# EAGLE design RPCamV2_Alt_camera_board (EAGLE 9.3.0)
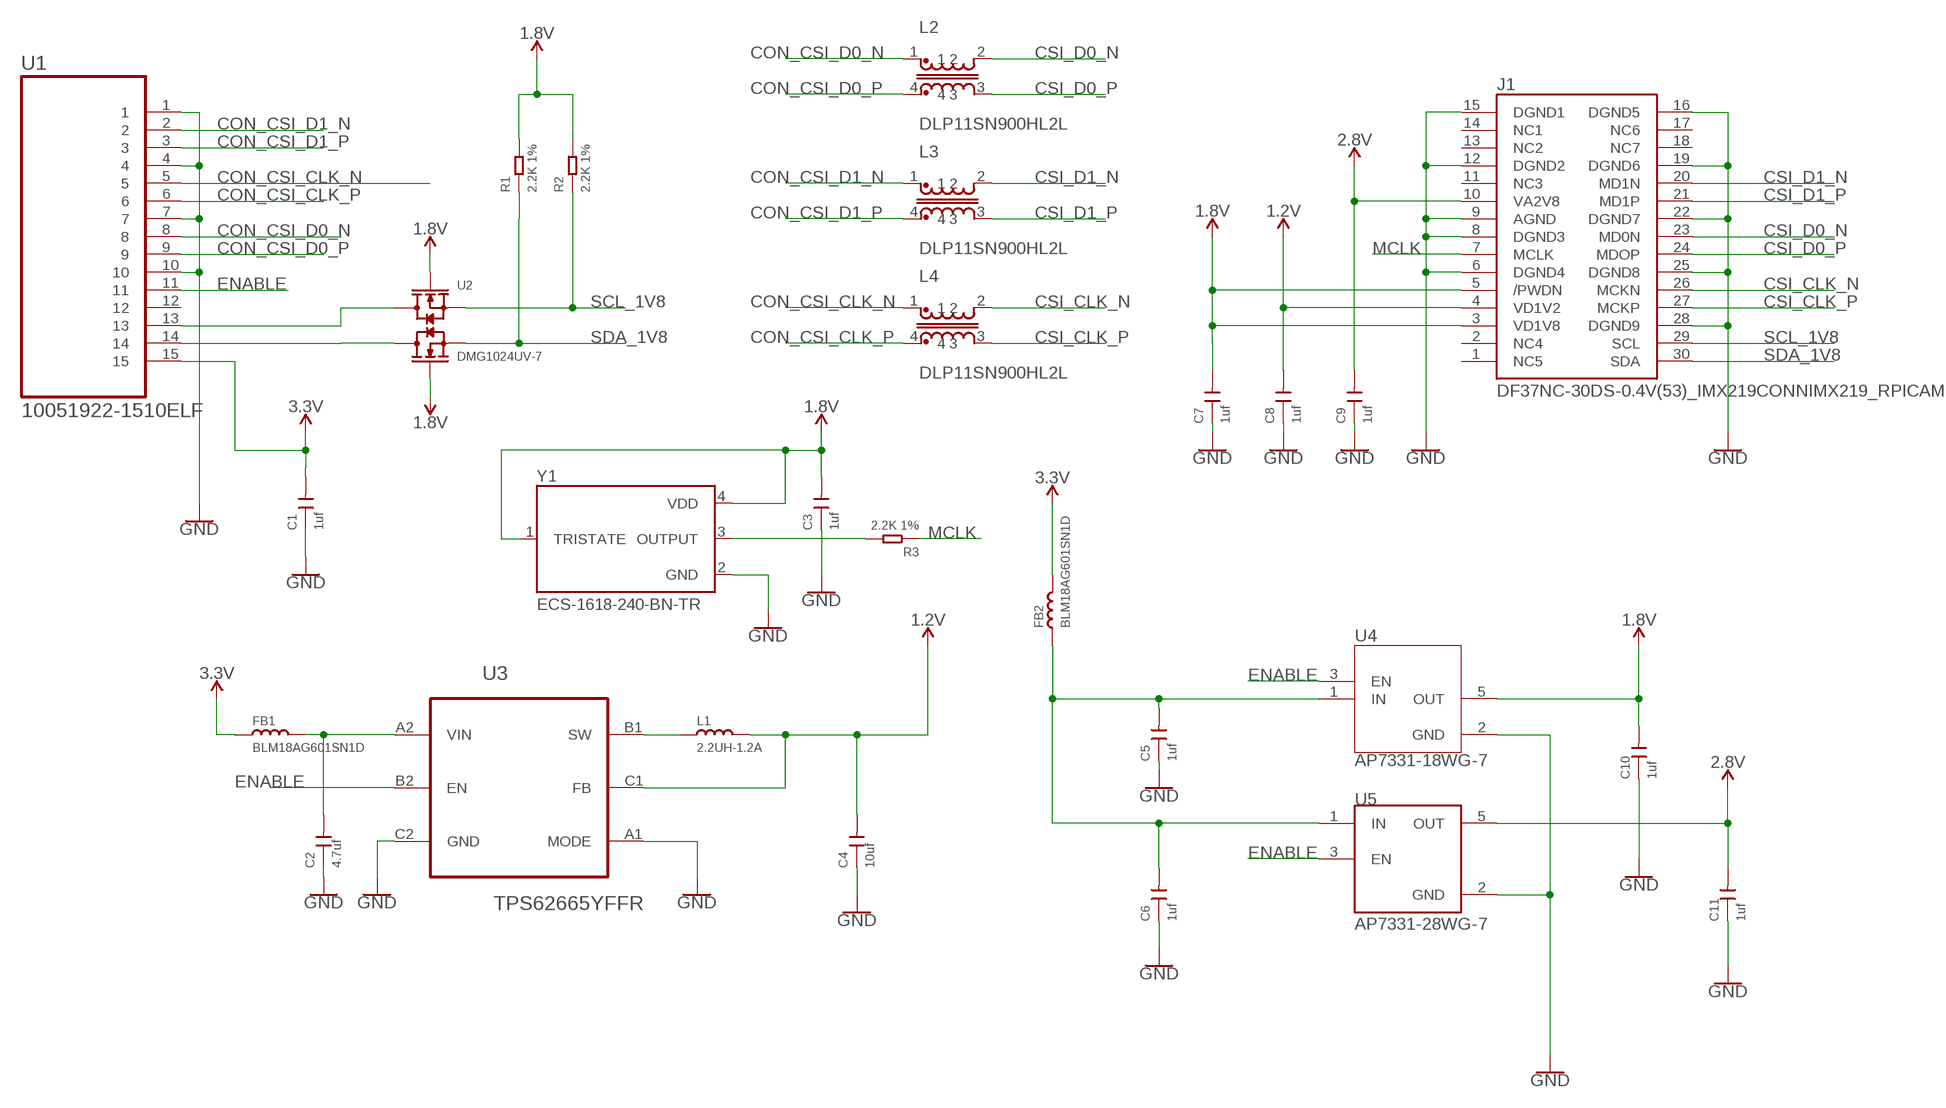
[diagram p0: schematic, sheet 1]

## Parts
C1  1uf  CERAMIC-1UF-10V-10%-X5R(0402)  [C0402]
C2  4.7uf  CERAMIC-4.7UF-10V-10%-X5R(0603)  [C0603]
C3  1uf  CERAMIC-1UF-10V-10%-X5R(0402)  [C0402]
C4  10uf  CERAMIC-10UF-25V-10%-X5R(0805)  [C0805]
C5  1uf  CERAMIC-1UF-10V-10%-X5R(0402)  [C0402]
C6  1uf  CERAMIC-1UF-10V-10%-X5R(0402)  [C0402]
C7  1uf  CERAMIC-1UF-10V-10%-X5R(0402)  [C0402]
C8  1uf  CERAMIC-1UF-10V-10%-X5R(0402)  [C0402]
C9  1uf  CERAMIC-1UF-10V-10%-X5R(0402)  [C0402]
C10  1uf  CERAMIC-1UF-10V-10%-X5R(0402)  [C0402]
C11  1uf  CERAMIC-1UF-10V-10%-X5R(0402)  [C0402]
FB1  BLM18AG601SN1D  [LEDM1608X80]
FB2  BLM18AG601SN1D  [LEDM1608X80]
J1  DF37NC-30DS-0.4V(53)_IMX219CONNIMX219_RPICAM  [HRS_DF37NC-30DS-0.4V(53)_IMX219]
L1  2.2UH-1.2A  SMD-INDUCTOR-2.2UH-20%-1.2A(0805)  [L0805]
L2  DLP11SN900HL2L  [INDC1210X09]
L3  DLP11SN900HL2L  [INDC1210X09]
L4  DLP11SN900HL2L  [INDC1210X09]
R1  2.2K 1%  SMD-RES-0R-5%-1/16W(0402)  [R0402]
R2  2.2K 1%  SMD-RES-0R-5%-1/16W(0402)  [R0402]
R3  2.2K 1%  SMD-RES-0R-5%-1/16W(0402)  [R0402]
U1  10051922-1510ELF  [FCI_10051922-1510ELF]
U2  DMG1024UV-7  [SOT50P162X60-6N]
U3  TPS62665YFFR  [BGA6C40P2X3_130X93X63]
U4  AP7331-18WG-7  [SOT95P285X145-5N]
U5  AP7331-28WG-7  [SOT95P285X145-5N]
Y1  ECS-1618-240-BN-TR  [XTAL_ECS-1618-060-BN-TR]

## Nets
1.2V [pwr]: C4.2 C8.2 J1.4(VD1V2) L1.2 U3.C1(FB)
1.8V [pwr]: C3.2 C7.2 C10.2 J1.3(VD1V8) J1.5(/PWDN) R1.2 R2.2 U2.G1(G0) U2.G2(G1) U4.5(OUT) Y1.1(TRISTATE) Y1.4(VDD)
2.8V [pwr]: C9.2 C11.2 J1.10(VA2V8) U5.5(OUT)
3V3 [pwr]: C1.2 FB1.A FB2.C U1.15 ; supply symbol labelled 3.3V
CON_CSI_CLK_N [diff pairs]: L4.1 U1.5
CON_CSI_CLK_P [diff pairs]: L4.4 U1.6
CON_CSI_D0_N [diff pairs]: L2.1 U1.8
CON_CSI_D0_P [diff pairs]: L2.4 U1.9
CON_CSI_D1_N [diff pairs]: L3.1 U1.2
CON_CSI_D1_P [diff pairs]: L3.4 U1.3
CSI_CLK_N [diff pairs]: J1.26(MCKN) L4.2
CSI_CLK_P [diff pairs]: J1.27(MCKP) L4.3
CSI_D0_N [diff pairs]: J1.23(MD0N) L2.2
CSI_D0_P [diff pairs]: J1.24(MDOP) L2.3
CSI_D1_N [diff pairs]: J1.20(MD1N) L3.2
CSI_D1_P [diff pairs]: J1.21(MD1P) L3.3
ENABLE: U1.11 U3.B2(EN) U4.3(EN) U5.3(EN)
GND [pwr]: C1.1 C2.1 C3.1 C4.1 C5.1 C6.1 C7.1 C8.1 C9.1 C10.1 C11.1 J1.6(DGND4) J1.8(DGND3) J1.9(AGND) J1.12(DGND2) J1.15(DGND1) J1.16(DGND5) J1.19(DGND6) J1.22(DGND7) J1.25(DGND8) J1.28(DGND9) U1.1 U1.4 U1.7 U1.10 U3.A1(MODE) U3.C2(GND) U4.2(GND) U5.2(GND) Y1.2(GND)
IN_PR: C5.2 C6.2 FB2.A U4.1(IN) U5.1(IN)
MCLK: J1.7(MCLK) R3.1
N$1: C2.2 FB1.C U3.A2(VIN)
N$2: U1.13 U2.D2(D1)
N$3: U1.14 U2.D1(D0)
N$5: R3.2 Y1.3(OUTPUT)
N$7 [pwr]: L1.1 U3.B1(SW)
SCL_1V8: J1.29(SCL) R2.1 U2.S2(S1)
SDA_1V8: J1.30(SDA) R1.1 U2.S1(S0)
Unconnected: J1.1(NC5) J1.2(NC4) J1.11(NC3) J1.13(NC2) J1.14(NC1) J1.17(NC6) J1.18(NC7) U1.12

## Library data of the parts
C1 C3 C5-C11 = Seeed-Capacitor:CERAMIC-1UF-10V-10%-X5R(0402): 302010040; MPN: CC0402KRX5R6BB105
C2 = Seeed-Capacitor:CERAMIC-4.7UF-10V-10%-X5R(0603): 302010111; MPN: CC0603KRX5R6BB475
C4 = Seeed-Capacitor:CERAMIC-10UF-25V-10%-X5R(0805): 302010178; MPN: CC0805KKX5R8BB106
FB1 FB2 = RPI_CAM:BLM18AG601SN1D
J1 = RPI_CAM:DF37NC-30DS-0.4V(53)_IMX219CONN: Connector, Stacking, Rcpt, 30pos, 2row
L1 = Seeed-Inductor:SMD-INDUCTOR-2.2UH-20%-1.2A(0805): 303010086; MPN: LQM2MPN2R2MG0
L2-L4 = DLP11SN900HL2L:DLP11SN900HL2L: MURATA# DLP11SN900HL2L, D LP Series 90 Ohm Impedanc e 20 % 150 mA DCR 1.5 Ohm SMT Common Mode Choke; AVAILABILITY: Unavailable; DESCRIPTION: MURATA# DLP11SN900HL2L, D LP Series 90 Ohm Impedanc e 20 % 150 mA DCR 1.5 Ohm SMT Common Mode Choke; MF: Murata; MP: DLP11SN900HL2L; PACKAGE: 1210 Murata; PRICE: None
R1-R3 = Seeed-Resistor:SMD-RES-0R-5%-1/16W(0402): 301010000; MPN: RC0402JR-070RL; VALUE: 0R
U1 = RPI_CAM:10051922-1510ELF: FFC/FPC CONNECTOR, 15POS, 1ROW; AVAILABILITY: Good; DESCRIPTION: Conn; Rect; FPC/FFC; ZIF; 15Cnts; SMT; VLL Series; 0.5mmPinSpng; RtAng; LowerSideContact; MF: FCI; MP: 10051922-1510ELF; PACKAGE: None; PRICE: 0.44 USD
U2 = RPI_CAM:DMG1024UV-7: Dual N-Channel 20 V 450 mOhm Surface Mount Enhancement Mode Mosfet - SOT-563; AVAILABILITY: Good; DESCRIPTION: Dual N-Channel 20 V 450 mOhm Surface Mount Enhancement Mode Mosfet - SOT-563; MF: Diodes Inc.; MP: DMG1024UV-7; PACKAGE: SOT-563 Diodes Inc.; PRICE: 0.19 USD
U3 = RPI_CAM:TPS62665YFFR: STEP-DOWN CONVERTER; AVAILABILITY: Good; DESCRIPTION: 1000mA, 6-MHz Synchronous Step-Down Converter in Chip Scale Packaging 6-DSBGA -40 to 85; MF: Texas Instruments; MP: TPS62665YFFR; PACKAGE: DSBGA-6 Texas Instruments; PRICE: 0.98 USD
U4 = RPI_CAM:AP7331-18WG-7: LDO Regulator Pos 1.8V 0.3A 5-Pin SOT-25 T/R; AVAILABILITY: Good; DESCRIPTION: LDO Regulator Pos 1.8V 0.3A 5-Pin SOT-25 T/R; MF: Diodes Inc.; MP: AP7331-18WG-7; PACKAGE: SOT-753 Diodes Inc.; PRICE: 0.20 USD
U5 = RPI_CAM:AP7331-28WG-7: LDO Regulator Pos 2.8V 0.3A 5-Pin SOT-25 T/R; AVAILABILITY: Good; DESCRIPTION: LDO Regulator Pos 2.8V 0.3A 5-Pin SOT-25 T/R; MF: Diodes Inc.; MP: AP7331-28WG-7; PACKAGE: SOT-753 Diodes Inc.; PRICE: 0.21 USD
Y1 = RPI_CAM:ECS-1618-240-BN-TR: OSC XO 12.000MHZ CMOS SMD; DESCRIPTION: Clock Oscillator 24MHz 1.8V 15pF 4-Pin SMD T/R; DIGI-KEY_PART_NUMBER: XC1963CT-ND; DIGI-KEY_PURCHASE_URL: https://www.digikey.com.au/product-detail/en/ecs-inc/ECS-1618-240-BN-TR/XC1963CT-ND/3927364?utm_source=snapeda&utm_medium=aggregator&utm_campaign=symbol; MF: ECS International; MP: ECS-1618-240-BN-TR; PACKAGE: SMD-4 ECS International

## Net classes
1 diff pairs: width 0.152 mm, clearance 0.152 mm
2 pwr: width 0.203 mm

## Board
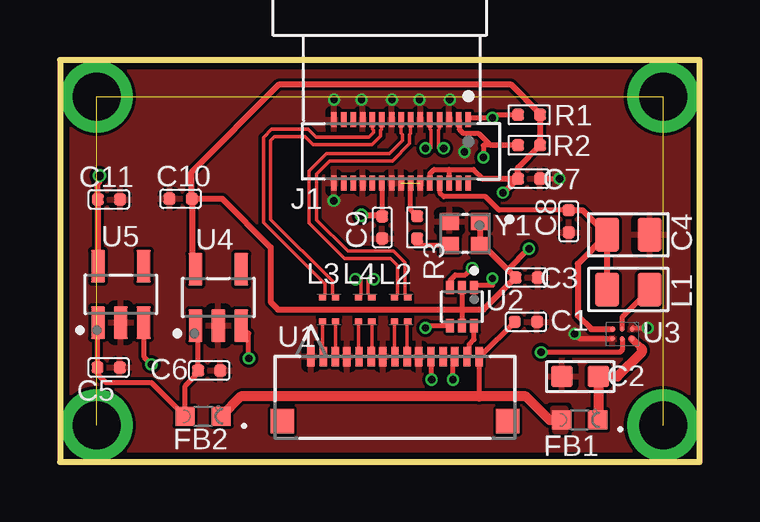
[diagram p1: board, top side]
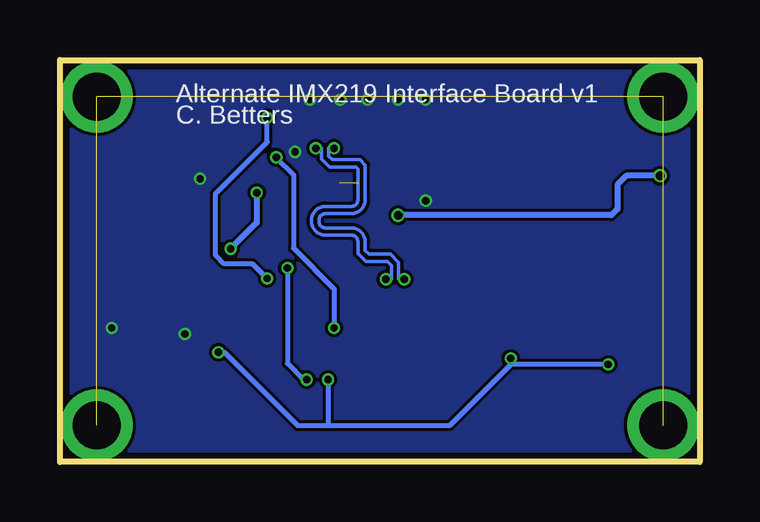
[diagram p2: board, bottom side, seen from below]

Size 26.67 x 16.76 mm. Coordinates in mm from the lower left corner, seen from the top.
Outline: 0,0 26.67,0 26.67,16.76 0,16.76 0,0
Copper layers (1*2*15*16): Top 0.035mm / dielectric 0.23mm / Route2 0.035mm / dielectric 0.93mm / Route15 0.035mm / dielectric 0.23mm / Bottom 0.035mm
Design rules "MF_Standard_4_Layer": minimum track width 5mil, minimum drill 10mil, track to track 5mil, track to pad 5mil, pad to pad 5mil, via to via 5mil, smd to smd 0mil, copper to edge 10mil, drill to drill 10mil, minimum pad ring 4mil, minimum via ring 4mil, stop-mask expansion 2mil, vias tented up to drill 25mil, thermal gap 10mil

### Footprints (pad centres in the part's own frame; a part is rotated, then mirrored left to right if it is on the bottom)
C0402 = smd 0.5 x 0.5: 1 0,0.463; 2 0,-0.463
C0603 = smd 0.889 x 0.889: 1 0,0.762; 2 0,-0.762
C0805 = smd 1.397 x 1.016: 1 0,0.889; 2 0,-0.889
LEDM1608X80 = smd 0.8 x 0.8: A 0.75,0; C -0.75,0
HRS_DF37NC-30DS-0.4V(53)_IMX219 = smd 0.23 x 0.63: 1 -2.8,1.325; 2 -2.4,1.325; 3 -2,1.325; 4 -1.6,1.325; 5 -1.2,1.325; 6 -0.8,1.325; 7 -0.4,1.325; 8 0,1.325; 9 0.4,1.325; 10 0.8,1.325; 11 1.2,1.325; 12 1.6,1.325; 13 2,1.325; 14 2.4,1.325; 15 2.8,1.325; 16 2.8,-1.325; 17 2.4,-1.325; 18 2,-1.325; 19 1.6,-1.325; 20 1.2,-1.325; 21 0.8,-1.325; 22 0.4,-1.325; 23 0,-1.325; 24 -0.4,-1.325; 25 -0.8,-1.325; 26 -1.2,-1.325; 27 -1.6,-1.325; 28 -2,-1.325; 29 -2.4,-1.325; 30 -2.8,-1.325
L0805 = smd 1.016 x 1.397: 1 -0.889,0; 2 0.889,0
INDC1210X09 = smd 0.25 x 0.3: 1 -0.5,0.275; 2 0.5,0.275; 3 0.5,-0.275; 4 -0.5,-0.275
R0402 = smd 0.5 x 0.5: 1 0,0.463; 2 0,-0.463
FCI_10051922-1510ELF = smd 0.305 x 0.813: 1 3.505,-2.108; 2 2.997,-2.108; 3 2.489,-2.108; 4 2.007,-2.108; 5 1.499,-2.108; 6 0.991,-2.108; 7 0.508,-2.108; 8 0,-2.108; 9 -0.508,-2.108; 10 -0.991,-2.108; 11 -1.499,-2.108; 12 -2.007,-2.108; 13 -2.489,-2.108; 14 -2.997,-2.108; 15 -3.505,-2.108 | smd 0.965 x 1.016: 16 -4.699,0.584; 17 4.699,0.584
SOT50P162X60-6N = smd 0.55 x 0.34: D1 0.795,0.5; D2 -0.795,-0.5; G1 -0.795,0; G2 0.795,0; S1 -0.795,0.5; S2 0.795,-0.5
BGA6C40P2X3_130X93X63 = smd 0.203 x 0.203: A1 -0.203,0.406; A2 0.203,0.406; B1 -0.203,0; B2 0.203,0; C1 -0.203,-0.406; C2 0.203,-0.406
SOT95P285X145-5N = smd 1.37 x 0.59: 1 -1.175,0.95; 2 -1.175,0; 3 -1.175,-0.95; 4 1.175,-0.95; 5 1.175,0.95
XTAL_ECS-1618-060-BN-TR = smd 0.8 x 0.7: 1 -0.65,-0.5; 2 0.65,-0.5; 3 0.65,0.5; 4 -0.65,0.5

### Placement (x,y rotation side)
C1  19.43,5.84 270 top
C2  21.69,3.56 90 top
C3  19.46,7.69 270 top
C4  23.7,9.47 270 top
C5  2.03,3.94 270 top
C6  6.22,3.81 270 top
C7  19.56,11.81 270 top
C8  21.21,10.03 180 top
C9  13.44,9.78 180 top
C10  5.03,10.97 90 top
C11  2.04,10.95 270 top
FB1  21.67,1.75 180 top
FB2  5.97,1.91 180 top
J1  14.22,12.95 180 top
L1  23.7,7.19 180 top
L2  14.22,6.35 90 top
L3  11.22,6.37 90 top
L4  12.73,6.37 90 top
R1  19.56,14.48 90 top
R2  19.56,13.21 90 top
R3  14.89,9.78 0 top
U1  13.97,2.29 180 top
U2  16.76,6.48 270 top
U3  23.44,5.33 270 top
U4  6.6,6.86 90 top
U5  2.54,6.99 90 top
Y1  16.89,9.53 180 top

### Tracks (layer width: path | path; a pad name or v marks a point on that pad's centre or on a via)
1.2V
  Top 0.203: C8.2 18.31,10.49 17.74,11.06 16,11.06 15.82,11.24 J1.4
  Top 0.254: C4.2 21.79,10.49 C8.2 | C4.2 L1.2 | C4.2 21.59,8.26 21.59,6.1 22.15,5.54 U3.C1
  Top 0.305: C8.2
1.8V  (via drill 0.3, 0.3 pad 0.36)
  Top 0.203: 16.23,12.2 J1.3 | J1.5 15.42,12.02 15.6,12.2 16.23,12.2 | 16.23,12.2 17.24,12.2 17.63,11.81 | U2.G1 16.76,6.36 U2.G2
  Top 0.254: C7.2 19.1,12.28 R2.2 R1.2 20.02,14.52 18.8,15.75 9.14,15.75 5.49,12.1 C10.2 | 17.63,11.81 C7.2 | C7.2 18.51,11.23 v18.47,11.23 | C3.2 17.66,9.03 Y1.4 Y1.1 | C3.2 17.66,6.36 16.76,6.36 9.09,6.36 8.78,6.67 8.78,8.95 6.76,10.97 C10.2 | v19.56,8.89 18.67,8.01 C3.2 | C10.2 5.53,10.94 5.53,8.16 U4.5
  Bottom 0.254: v19.56,8.89 18.47,9.98 v18.47,11.23
2.8V  (via drill 0.35)
  Top 0.203: J1.10 13.43,10.25 C9.2
  Top 0.254: U5.5 1.59,10.94 C11.2 1.58,11.61 1.65,11.68 v1.65,11.94 | v12.57,10.29 13.39,10.29 C9.2
  Bottom 0.254: v12.57,10.29 3.68,10.29 3.43,10.54 3.43,11.56 3.05,11.94 v1.65,11.94
3V3
  Top 0.203: C1.2 17.52,4.39 U1.15 17.48,2.73
  Top 0.406: FB1.A 20.41,1.75 19.43,2.73 17.48,2.73 7.54,2.73 FB2.C
  pour Top (no thermals): 20.68,1.3 21.06,1.3 21.06,2.18 20.57,2.18
CON_CSI_CLK_N
  Top 0.152: L4.1 12.45,4.41 U1.5
CON_CSI_CLK_P
  Top 0.152: L4.4 13,4.42 U1.6
CON_CSI_D0_N
  Top 0.152: L2.1 13.95,4.42 U1.8
CON_CSI_D0_P
  Top 0.152: L2.4 14.48,5.83 U1.9
CON_CSI_D1_N
  Top 0.152: L3.1 10.94,4.42 U1.2
CON_CSI_D1_P
  Top 0.152: L3.4 11.49,4.41 U1.3
CSI_CLK_N  (via drill 0.3)
  Top 0.152: J1.26 15.42,13.89 15.47,13.84 15.47,13.08 v15.24,13.08 | L4.2 12.55,6.96 12.55,7.62 v12.32,7.62
  Bottom 0.152: v12.32,7.62 12.55,7.62 12.55,8.32 12.89,8.66 13.78,8.66 13.95,8.83 13.95,9.19 arc-90 14.52,9.76 15.61,9.76 arc90 15.88,10.03 15.88,10.08 arc90 15.61,10.35 14.52,10.35 arc-90 13.95,10.92 13.95,12.38 14.16,12.6 15.3,12.6 15.47,12.76 15.47,13.08 v15.24,13.08
CSI_CLK_P  (via drill 0.3)
  Top 0.152: J1.27 15.82,13.89 15.77,13.84 15.77,13.08 v16,13.08 | L4.3 12.85,7.02 12.85,7.62 v13.08,7.62
  Bottom 0.152: v13.08,7.62 12.85,7.62 12.85,8.19 13.02,8.36 13.91,8.36 14.25,8.7 14.25,9.19 arc-90 14.52,9.46 15.61,9.46 arc90 16.18,10.03 16.18,10.08 arc90 15.61,10.65 14.52,10.65 arc-90 14.25,10.92 14.25,12.22 14.33,12.29 15.43,12.29 15.77,12.64 15.77,13.08 v16,13.08
CSI_D0_N
  Top 0.152: J1.23 14.22,13.7 14.28,13.65 14.28,13.4 13.73,12.85 11.11,12.85 10.39,12.13 10.39,9.97 11.88,8.48 13.78,8.48 14.07,8.19 14.07,6.97 L2.2
CSI_D0_P
  Top 0.152: J1.24 14.62,13.69 14.58,13.65 14.58,13.27 13.86,12.55 11.24,12.55 10.69,12 10.69,10.1 12,8.79 13.91,8.79 14.38,8.32 14.38,6.97 L2.3
CSI_D1_N
  Top 0.152: L3.2 11.06,6.98 11.06,7.42 8.48,9.99 8.48,13.53 8.83,13.87 10.35,13.87 10.68,13.54 12.88,13.54 13.06,13.73 13.06,13.83 13.02,13.87 J1.20
CSI_D1_P
  Top 0.152: L3.3 11.36,7 11.36,7.54 8.79,10.11 8.79,13.4 8.95,13.56 10.22,13.56 10.55,13.24 13.02,13.24 13.37,13.59 13.37,13.83 13.4,13.87 13.4,14.26 J1.21
ENABLE  (via drill 0.3 pad 0.36)
  Top 0.203: U1.11 15.47,3.45 v15.49,3.43 | v7.87,4.32 7.87,5.36 U4.3 | U5.3 3.49,4.38 v3.81,4.06 | U3.B2 23.44,4.67 23.35,4.57 v20.07,4.57
  Bottom 0.203: 15.49,1.52 10.41,1.52 7.87,4.06 | 7.87,4.06 v7.87,4.32 | v3.81,4.06 7.87,4.06 | v20.07,4.57 19.81,4.57 16.76,1.52 15.49,1.52 | v15.49,3.43 15.49,1.52
GND  (via drill 0.3)  (1 unrouted)
  Top 0.203: C7.1 v20.83,11.81 | U3.A1 23.9,5.59 v24.51,5.59 | U3.C2 21.67,5.13 v21.46,5.33
  other vias: 16.86,12.93 11.42,10.89 11.43,15.11 12.57,15.11 13.84,15.11 14.99,15.11 16.26,15.11
  pour Top (rank 3): 0.33,16.46 26.72,16.46 26.72,0.1 0.1,0.1 0.1,16.23
  pour Bottom (rank 2): 0,16.26 26.42,16.26 26.42,0.13 0,0.13
IN_PR
  Top 0.203: U5.1 1.57,5.79 C5.2 1.57,3.65 1.92,3.3 3.82,3.3 FB2.A 5.22,3.17 5.76,3.72 C6.2 5.76,5.58 U4.1
MCLK
  Top 0.203: R3.1 14.62,10.51 J1.7
N$1
  Top 0.305: U3.A2 24.26,4.72
  Top 0.406: 24.26,4.72 24.26,4.57 23.24,3.56 C2.2 22.45,1.79 FB1.C
N$2  (via drill 0.3)
  Top 0.203: v17.19,8.09 16.9,7.8 16.49,7.8 16.26,7.58 U2.D2 | v16.38,3.43 16.38,4.32 U1.13
  Bottom 0.203: v17.19,8.09 17.19,4.11 16.51,3.43 v16.38,3.43
N$3
  Top 0.203: U1.14 17.07,4.5 17.07,4.91 17.26,5.1 U2.D1
N$4  (via drill 2)  (3 unrouted)
  other vias: 1.52,15.24 1.52,1.52 25.15,1.52 25.15,15.24
N$5
  Top 0.203: R3.2 14.75,9.18 14.91,9.03 Y1.3
N$7
  Top 0.203: U3.B1 23.44,6.04 L1.1
SCL_1V8  (via drill 0.3, 0.3 pad 0.36)
  Top 0.203: v17.65,12.7 17.65,13.21 R2.1 17.95,13.21 17.45,13.71 16.8,13.71 16.66,13.86 16.66,14.25 J1.29 | v15.24,5.59 15.24,5.68 U2.S2
  Bottom 0.203: v17.65,12.7 16.94,11.98 16.94,8.92 15.24,7.22 v15.24,5.59
SDA_1V8  (via drill 0.3, 0.3 pad 0.36)
  Top 0.203: U2.S1 17.33,7.27 17.33,7.38 18.03,7.38 v18.03,7.65 | R1.1 18.16,14.48 v18.03,14.35 17.1,14.35 J1.30
  Bottom 0.203: v18.03,7.65 18.64,8.26 19.82,8.26 20.19,8.63 20.19,11.18 18.03,13.34 v18.03,14.35

### Text on the board
bPlace: Alternate IMX219 Interface Board v1 | C. Betters